# Altium schematic sheet LCD_Dev_SCH_0.SchDoc
size A
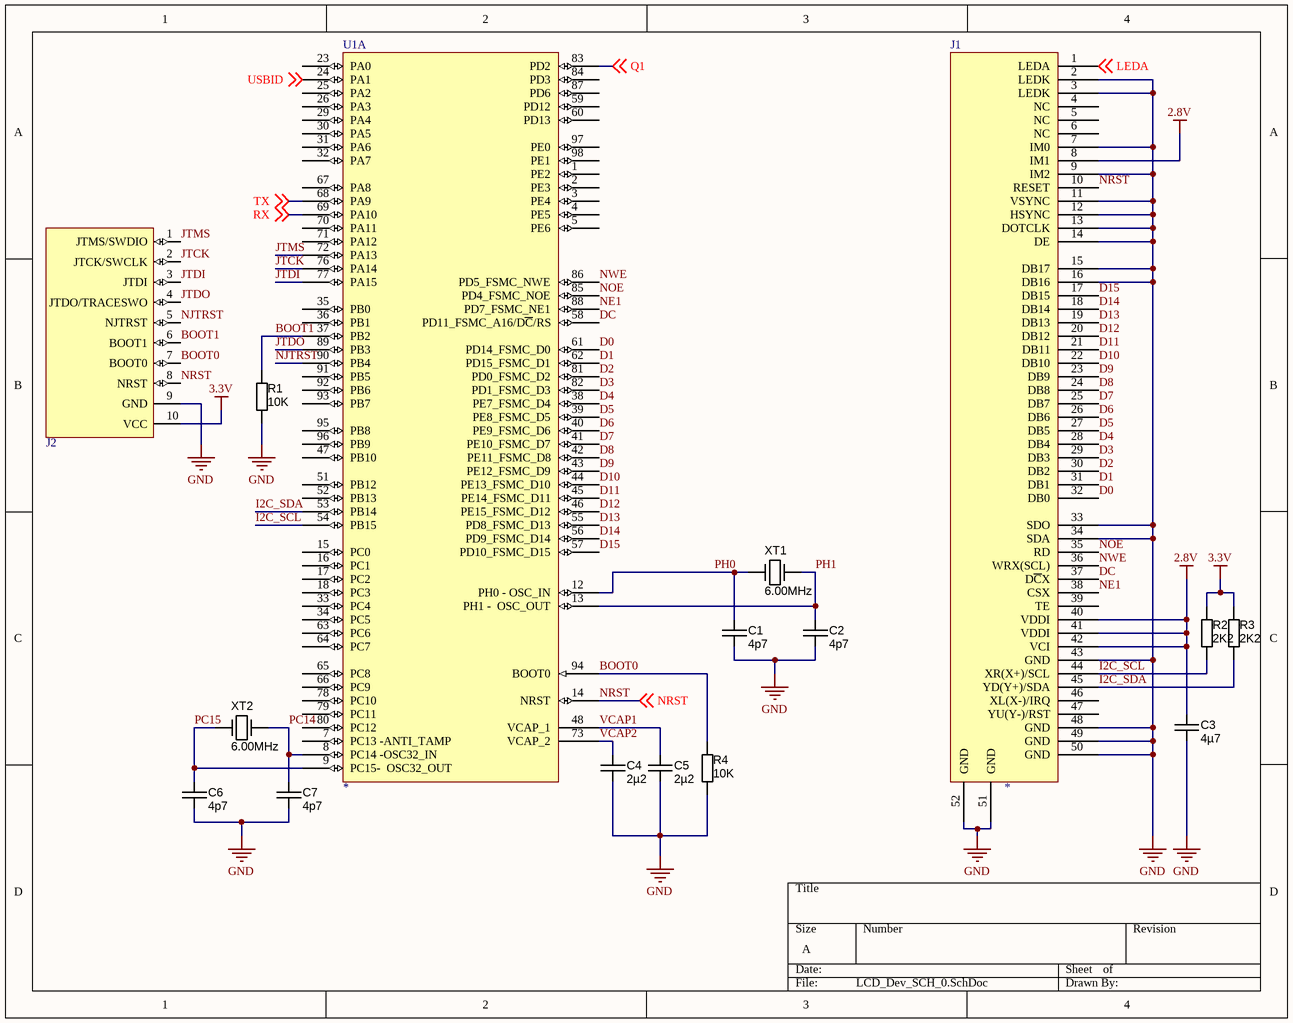
[diagram p0: LCD_Dev_SCH_0.SchDoc]

## Parts
C1  value 4p7  [CAPC1608X90N]  (hidden comment: approved sub OK)
C2  value 4p7  [CAPC1608X90N]  (hidden comment: approved sub OK)
C3  value 4µ7  [CAPC2012X135N]  (hidden comment: approved sub OK)
C4  value 2µ2  [CAPC2012X135N]  (hidden comment: approved sub OK)
C5  value 2µ2  [CAPC2012X135N]  (hidden comment: approved sub OK)
C6  value 4p7  [CAPC1608X90N]  (hidden comment: approved sub OK)
C7  value 4p7  [CAPC1608X90N]  (hidden comment: approved sub OK)
J1  *  [ER-CON50HT-1]
J2  *  [SWJ-DP connector]  (value not drawn)
R1  value 10K  [RESC1608X55N]  (hidden comment: Thick Film)
R2  value 2K2  [RESC1608X55N]  (hidden comment: Thick Film)
R3  value 2K2  [RESC1608X55N]  (hidden comment: Thick Film)
R4  value 10K  [RESC1608X55N]  (hidden comment: Thick Film)
U1  *  [LQFP100_STM32F4]  (part A of 2)
XT1  6.00MHz  [CRYSTAL_HC49-US-SM]
XT2  6.00MHz  [CRYSTAL_HC49-US-SM]

## Nets
2.8V: C3.1 J1.8(IM1) J1.40(VDDI) J1.41(VDDI) J1.42(VCI)
3.3V: J2.10(VCC) R2.1 R3.1
GND: C1.2 C2.2 C3.2 C4.2 C5.2 C6.2 C7.2 J1.2(LEDK) J1.3(LEDK) J1.7(IM0) J1.9(IM2) J1.11(VSYNC) J1.12(HSYNC) J1.13(DOTCLK) J1.14(DE) J1.15(DB17) J1.16(DB16) J1.33(SDO) J1.34(SDA) J1.43(GND) J1.48(GND) J1.49(GND) J1.50(GND) J1.51(GND) J1.52(GND) J2.9(GND) R1.2 R4.2
BOOT0: J2.7(BOOT0) R4.1 U1.94(BOOT0)
BOOT1: J2.6(BOOT1) R1.1 U1.37(PB2)
D0: J1.32(DB0) U1.61(PD14_FSMC_D0)
D1: J1.31(DB1) U1.62(PD15_FSMC_D1)
D2: J1.30(DB2) U1.81(PD0_FSMC_D2)
D3: J1.29(DB3) U1.82(PD1_FSMC_D3)
D4: J1.28(DB4) U1.38(PE7_FSMC_D4)
D5: J1.27(DB5) U1.39(PE8_FSMC_D5)
D6: J1.26(DB6) U1.40(PE9_FSMC_D6)
D7: J1.25(DB7) U1.41(PE10_FSMC_D7)
D8: J1.24(DB8) U1.42(PE11_FSMC_D8)
D9: J1.23(DB9) U1.43(PE12_FSMC_D9)
D10: J1.22(DB10) U1.44(PE13_FSMC_D10)
D11: J1.21(DB11) U1.45(PE14_FSMC_D11)
D12: J1.20(DB12) U1.46(PE15_FSMC_D12)
D13: J1.19(DB13) U1.55(PD8_FSMC_D13)
D14: J1.18(DB14) U1.56(PD9_FSMC_D14)
D15: J1.17(DB15) U1.57(PD10_FSMC_D15)
DC: J1.37(D~{C}X) U1.58(PD11_FSMC_A16/D~{C}/RS)
I2C_SCL: J1.44(XR(X+)/SCL) R2.2 U1.54(PB15)
I2C_SDA: J1.45(YD(Y+)/SDA) R3.2 U1.53(PB14)
JTCK: J2.2(JTCK/SWCLK) U1.76(PA14)
JTDI: J2.3(JTDI) U1.77(PA15)
JTDO: J2.4(JTDO/TRACESWO) U1.89(PB3)
JTMS: J2.1(JTMS/SWDIO) U1.72(PA13)
LEDA: J1.1(LEDA) ; off-sheet LEDA
NE1: J1.38(CSX) U1.88(PD7_FSMC_NE1)
NJTRST: J2.5(NJTRST) U1.90(PB4)
NOE: J1.35(RD) U1.85(PD4_FSMC_NOE)
NRST: J1.10(RESET) J2.8(NRST) U1.14(NRST) ; off-sheet NRST
NWE: J1.36(WRX(SCL)) U1.86(PD5_FSMC_NWE)
PC14: C7.1 U1.8(PC14_-OSC32_IN) XT2.2(OUT)
PC15: C6.1 U1.9(PC15-__OSC32_OUT) XT2.1(IN)
PH0: C1.1 U1.12(PH0_-_OSC_IN) XT1.1(IN)
PH1: C2.1 U1.13(PH1_-__OSC_OUT) XT1.2(OUT)
Q1: U1.83(PD2) ; off-sheet Q1
RX: U1.69(PA10) ; off-sheet RX
TX: U1.68(PA9) ; off-sheet TX
USBID: U1.24(PA1) ; off-sheet USBID
VCAP1: C5.1 U1.48(VCAP_1)
VCAP2: C4.1 U1.73(VCAP_2)

Not connected (* = marked no-connect by the designer): J1 4(NC) 5(NC) 6(NC) 39(TE) 46(XL(X-)/IRQ) 47(YU(Y-)/RST); U1 1(PE2) 2(PE3) 3(PE4) 4(PE5) 5(PE6) 7(PC13_-ANTI_TAMP) 15(PC0) 16(PC1) 17(PC2) 18(PC3) 23(PA0) 25(PA2) 26(PA3) 29(PA4) 30(PA5) 31(PA6) 32(PA7) 33(PC4) 34(PC5) 35(PB0) 36(PB1) 47(PB10) 51(PB12) 52(PB13) 59(PD12) 60(PD13) 63(PC6) 64(PC7) 65(PC8) 66(PC9) 67(PA8) 70(PA11) 71(PA12) 78(PC10) 79(PC11) 80(PC12) 84(PD3) 87(PD6) 91(PB5) 92(PB6) 93(PB7) 95(PB8) 96(PB9) 97(PE0) 98(PE1)

## Library data of the parts
C1 C2 C6 C7 = CAPC_4p7_100V_0603: Capacitor SMD Cer 4.7pF ±0.25pF 100V NP0 0603; Manufacturer 1: AVX Corporation; Manufacturer Part Number 1: 06031A4R7CAT2A; Ratings: 100V; NP0; SCDType: source*; Tolerance: ±0.25pF; Operating Temperature: -55°C ~ 125°C; Package / Case: 0603 (1608 metric); Supplier 1: Digi-Key; Supplier Part Number 1: 478-4992-1-ND
C3 = CAPC_4u7_0805: Capacitor SMD Cer 4.7uF 10% 16V X5R 0805; Manufacturer 1: Taiyo Yuden; Manufacturer Part Number 1: EMK212BJ475KG-T; Ratings: 16V; X5R; Material: ceramic; SCDType: spec; Package / Case: 0805 (2012 Metric); Tolerance: ±10%; Supplier 1: Digi-Key; Supplier Part Number 1: 587-1294-1-ND; Operating Temperature: -55°C ~ 85°C; Size / Dimension: 0.079" L x 0.049" W (2.00mm x 1.25mm); Thickness (Max): 0.053" (1.35mm); ComponentLink1URL: http://www.yuden.co.jp/productdata/catalog/en/mlcc01_e.pdf; ComponentLink1Description: http://www.yuden.co.jp/productdata/catalog/en/mlcc01_e.pdf; Supplier 2: Digi-Key; Supplier Part Number 2: 1276-1065-1-ND; Manufacturer 2: Samsung Electro-Mechanics America, Inc; Manufacturer Part Number 2: CL21A475KOFNNNE; RoHS 2: RoHS Compliant; ComponentLink2URL: http://www.samsungsem.com/servlet/FileDownload?type=spec&file=CL21A475KOFNNNE.pdf; ComponentLink2Description: http://www.samsungsem.com/servlet/FileDownload?type=spec&file=CL21A475KOFNNNE.pdf; Supplier 3: Digi-Key; Supplier Part Number 3: 399-8101-1-ND; Manufacturer 3: Kemet; Manufacturer Part Number 3: C0805C475K4PACTU; RoHS 3: RoHS Compliant; ComponentLink3URL: http://capacitoredge.kemet.com/capedge2/DataSheet?pn=C0805C475K4PACTU; ComponentLink3Description: http://capacitoredge.kemet.com/capedge2/DataSheet?pn=C0805C475K4PACTU; Supplier 4: Digi-Key; Supplier Part Number 4: 490-7215-1-ND; Manufacturer 4: Murata Electronics North America; Manufacturer Part Number 4: GRM21BR61C475MA88L; RoHS 4: RoHS Compliant; ComponentLink4URL: http://psearch.murata.com/capacitor/product/GRM21BR61C475MA88#.pdf; ComponentLink4Description: http://psearch.murata.com/capacitor/product/GRM21BR61C475MA88#.pdf; Supplier 5: Digi-Key; Supplier Part Number 5: 445-7640-1-ND; Manufacturer 5: TDK Corporation; Manufacturer Part Number 5: C2012X5R1C475K125AC; RoHS 5: RoHS Compliant; ComponentLink5URL: http://product.tdk.com/capacitor/mlcc/en/documents/mlcc_commercial_general_en.pdf; ComponentLink5Description: http://product.tdk.com/capacitor/mlcc/en/documents/mlcc_commercial_general_en.pdf; RoHS 1: RoHS Compliant
C4 C5 = CAPC_2u2_0805: Capacitor SMD Cer 2.2uF 10% 16V X7R 0805; Manufacturer 1: Kemet; Manufacturer Part Number 1: C0805C225K4RACTU; Ratings: 16V; X7R; SCDType: undef; Package / Case: 0805 (2012 metric); Tolerance: ±10%; Supplier 1: Digi-Key; Supplier Part Number 1: 399-3523-1-ND
J1 = LCD-Port: 3.5”TFT LCD Display Port (i80/6800/FSMC etc)
J2 = SWJ-Debug Port: 10 pin Serial Wire JTAG Debug Port
R1 R4 = RES_10K_0603_5%: Resistor SMD chip 10k Ohm 0.1W 5% 0603; Manufacturer 1: Yageo; Manufacturer Part Number 1: RC0603JR-0710KL; Ratings: 1/10 W; SCDType: spec; Package / Case: 0603 (1608 metric); Tolerance: ±5%; Manufacturer 2: Vishay Dale; Manufacturer Part Number 2: CRCW060310K0JNEA; Supplier 1: Digi-Key; Supplier Part Number 1: 311-10KGRCT-ND; ComponentLink1URL: http://www.yageo.com/documents/recent/PYu-RC0603_51_RoHS_L_4.pdf; ComponentLink1Description: http://www.yageo.com/documents/recent/PYu-RC0603_51_RoHS_L_4.pdf; Supplier 2: Digi-Key; Supplier Part Number 2: 541-10KGCT-ND; ComponentLink2URL: http://www.vishay.com/doc?20035; ComponentLink2Description: http://www.vishay.com/doc?20035; Material: Thick Film
R2 R3 = RES_2K2_0603_5%: Resistor SMD chip 2.2k Ohm 0.1W 5% 0603; Manufacturer 1: Yageo; Manufacturer Part Number 1: RC0603JR-072K2L; Ratings: 1/10 W; SCDType: spec; Temperature Coefficient: ±100ppm/°C; Package / Case: 0603 (1608 metric); Tolerance: ±5%; Material: Thick Film; Manufacturer 2: Samsung Electro-Mechanics America, Inc; Manufacturer Part Number 2: RC1608J222CS; Supplier 1: Digi-Key; Supplier Part Number 1: 311-2.2KGRDKR-ND; ComponentLink1URL: http://www.yageo.com/documents/recent/PYu-RC0603_51_RoHS_L_4.pdf; ComponentLink1Description: http://www.yageo.com/documents/recent/PYu-RC0603_51_RoHS_L_4.pdf; Supplier 2: Digi-Key; Supplier Part Number 2: 1276-5070-6-ND; ComponentLink2URL: http://www.samsungsem.com/servlet/FileDownload?filename=productcatalog/pdf/Chip_Resistor.pdf; ComponentLink2Description: http://www.samsungsem.com/servlet/FileDownload?filename=productcatalog/pdf/Chip_Resistor.pdf; RoHS 1: RoHS Compliant; RoHS 2: RoHS Compliant; Supplier 3: Digi-Key; Supplier Part Number 3: RMCF0603JT2K20DKR-ND; Manufacturer 3: Stackpole Electronics Inc; Manufacturer Part Number 3: RMCF0603JT2K20; RoHS 3: RoHS Compliant; ComponentLink3URL: http://www.seielect.com/Catalog/SEI-RMCF_RMCP.pdf; ComponentLink3Description: http://www.seielect.com/Catalog/SEI-RMCF_RMCP.pdf; Supplier 4: Digi-Key; Supplier Part Number 4: RHM2.2KCGDKR-ND; Manufacturer 4: Rohm Semiconductor; Manufacturer Part Number 4: MCR03ERTJ222; RoHS 4: RoHS Compliant; ComponentLink4URL: http://rohmfs.rohm.com/en/products/databook/datasheet/passive/resistor/chip_resistor/mcr_g.pdf; ComponentLink4Description: http://rohmfs.rohm.com/en/products/databook/datasheet/passive/resistor/chip_resistor/mcr_g.pdf; Supplier 5: Digi-Key; Supplier Part Number 5: P2.2KGDKR-ND; Manufacturer 5: Panasonic Electronic Components; Manufacturer Part Number 5: ERJ-3GEYJ222V; RoHS 5: RoHS Compliant; ComponentLink5URL: http://industrial.panasonic.com/www-cgi/jvcr13pz.cgi?E+PZ+3+AOA0001+ERJ3GEYJ222V+7+WW; ComponentLink5Description: http://industrial.panasonic.com/www-cgi/jvcr13pz.cgi?E+PZ+3+AOA0001+ERJ3GEYJ222V+7+WW
U1 = STM32F413xH: STM32F413VHT symbol for FSMC application with designated FSMC relevant pins
XT1 XT2 = Crystal_6MHz_HC49/US: Resonator Ceramic 6.00 MHz 30ppm; Manufacturer 1: CTS-Frequency Controls; Manufacturer Part Number 1: ATS060BSM-1; Frequency: 6MHz; Frequency Stability: ±50ppm; Load Capacitance: 18pF; Operating Mode: Fundamental; Parameter Name: 0.169" (4.30mm); SCDType: spec; Package / Case: HC49/US-SM; Ratings: 6.00 MHz; Supplier 1: Digi-Key; Supplier Part Number 1: CTX882CT-ND; Type: MHz Crystal; Frequency Tolerance: ±30ppm; Operating Temperature: -20°C ~ 70°C; Mounting Type: Surface Mount; Size / Dimension: 0.437" L x 0.190" W (11.10mm x 4.83mm); ComponentLink1URL: http://www.ctscorp.com/components/Datasheets/008-0309-0.pdf; ComponentLink1Description: http://www.ctscorp.com/components/Datasheets/008-0309-0.pdf